# Altium project MICROPROCESSOR.PrjPcb (part 2 of 2)
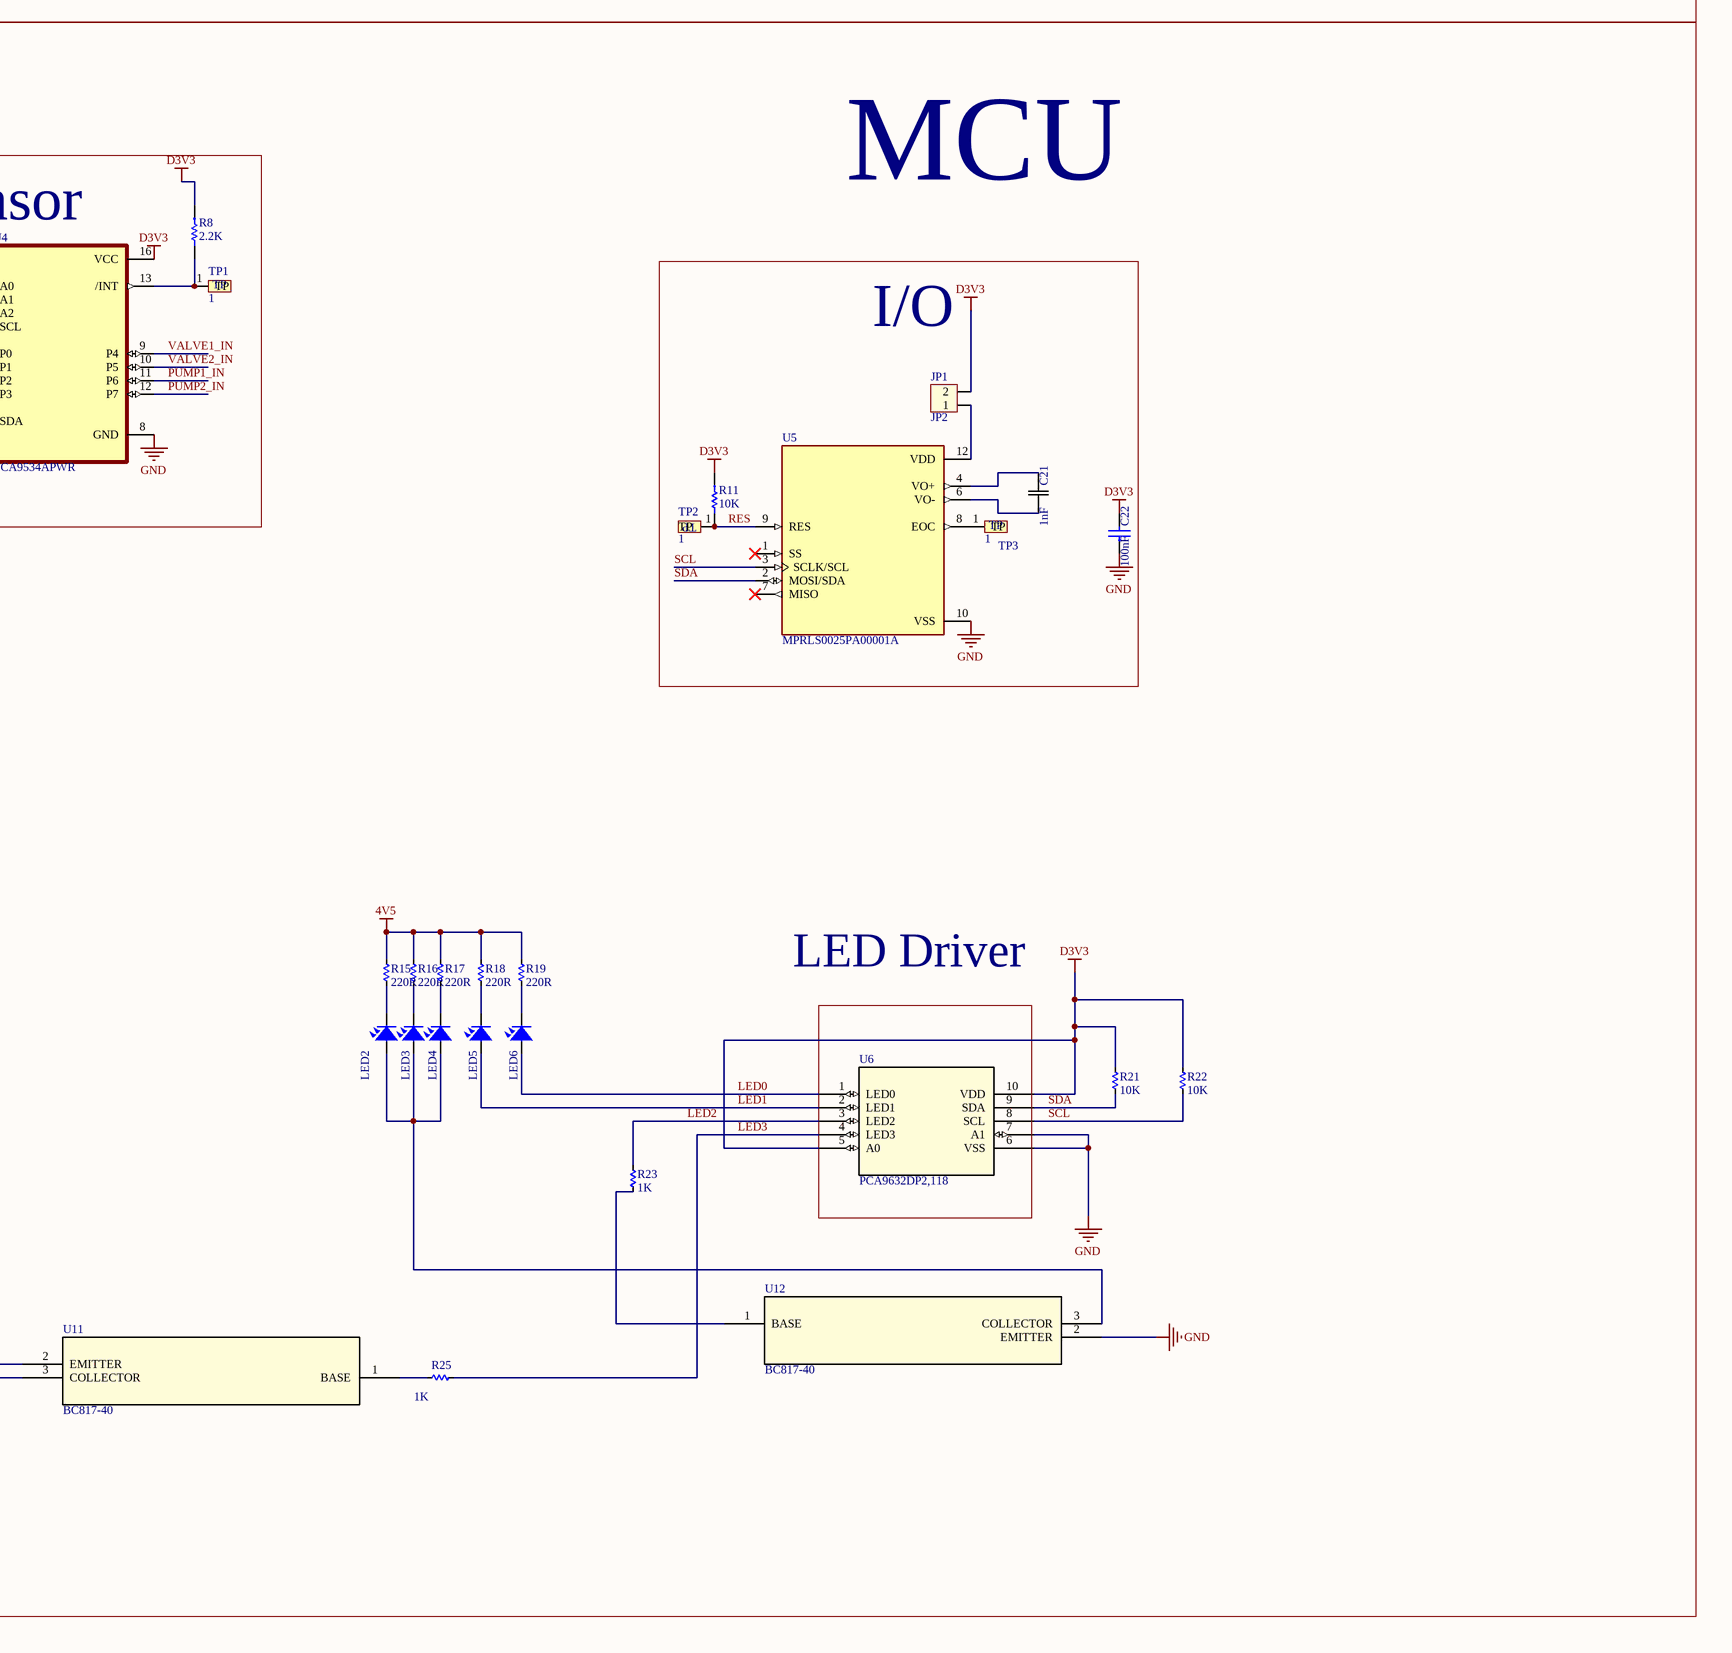
[diagram p4: schematic1.SchDoc, bottom right]

## Sheet schematic1.SchDoc (continued)

### Library data of the parts
C1 C8 = CAPCER0001 100nF 10% 50V X7R 0603 SMD_1: CAP CER 100nF 10% 50V X7R 0603 SMD; LINE: SMT; TYPE: EP; UNIT: PCS; TMG CODE: None; CERTIFICATION: NA; CLASS: B; Value: 100n; MOUNT: SMD; TMG PN: CAPCER0001; ComponentLink1Description: Datasheet; ComponentLink1URL: https://datasheet.lcsc.com/lcsc/1811021431_Samsung-Electro-Mechanics-CL10B104KB8NNNC_C1591.pdf; Footprint: 0603
C2 C10 = CL10A106MQ8NNNC: Description; Manufacturer_Name: Samsung; Copyright: Copyright (C) 2026 Ultra Librarian. All rights reserved.; Manufacturer_Part_Number: CL10A106MQ8NNNC
  C2: Value: 10uF
C3 C9 = CL10A106MQ8NNNC: Description; Manufacturer_Name: Samsung; Value: 10u; Copyright: Copyright (C) 2026 Ultra Librarian. All rights reserved.; Manufacturer_Part_Number: CL10A106MQ8NNNC
C4 C20 C22-C24 C28 C29 = CAPCER0001 100nF 10% 50V X7R 0603 SMD: CAP CER 100nF 10% 50V X7R 0603 SMD; LINE: SMT; TYPE: EP; UNIT: PCS; TMG CODE: None; CERTIFICATION: NA; CLASS: B; MOUNT: SMD; TMG PN: CAPCER0001; ComponentLink1Description: Datasheet; ComponentLink1URL: https://datasheet.lcsc.com/lcsc/1811021431_Samsung-Electro-Mechanics-CL10B104KB8NNNC_C1591.pdf; Footprint: 0603
C5-C7 C12 C13 = GRM188R60J226MEA0D: Description; Manufacturer_Name: Murata; Value: 22u; Copyright: Copyright (C) 2026 Ultra Librarian. All rights reserved.; Manufacturer_Part_Number: GRM188R60J226MEA0D
C11 = CAPCER0001 100nF 10% 50V X7R 0603 SMD: CAP CER 100nF 10% 50V X7R 0603 SMD; LINE: SMT; TYPE: EP; UNIT: PCS; TMG CODE: None; CERTIFICATION: NA; CLASS: B; Value: 100n; MOUNT: SMD; TMG PN: CAPCER0001; ComponentLink1Description: Datasheet; ComponentLink1URL: https://datasheet.lcsc.com/lcsc/1811021431_Samsung-Electro-Mechanics-CL10B104KB8NNNC_C1591.pdf; Footprint: 0603
C14 = GRM188R60J226MEA0D: Description; Manufacturer_Name: Murata; Copyright: Copyright (C) 2026 Ultra Librarian. All rights reserved.; Manufacturer_Part_Number: GRM188R60J226MEA0D
C15 C17 C18 = GMC10X7R106K10NT: CAP0603 X7R 10UF 10% 10V; manufacturer: Cal-Chip Electronics, Inc.; Capacitance: 10 µF; Part Number: GMC10X7R106K10NT; Value: 10u; Applications: General Purpose; componentlink1description: Datasheet; componentlink1url: https://88ce57.p3cdn1.secureserver.net/wp-content/uploads/2023/01/gmc_series-2.pdf; componentlink2description: DigiKey Link; componentlink2url: https://www.digikey.com/en/products/detail/cal-chip-electronics-inc/GMC10X7R106K10NT/18151126; Device Package: 0603 (1608 Metric); lastupdated: 2/9/2024 8:09:39 PM; Lifecycle Status: Active; Minimum Order: 1; Mounting Type: Surface Mount, MLCC; Operating Temperature: -55°C ~ 125°C; Package / Case: 0603 (1608 Metric); packaging: TapeAndReel; partid: 49835; Part Status: Active; price: 0.26; series: GMC; Size / Dimension: 0.063" L x 0.031" W (1.60mm x 0.80mm); Supplier 1: DigiKey; Supplier Part Number 1: 4713-GMC10X7R106K10NTCT-ND; Temperature Coefficient: X7R; Thickness (Max): 0.039" (1.00mm); Tolerance: ±10%; Voltage - Rated: 10V
C16 = GMC10X7R106K10NT: CAP0603 X7R 100nF 10% 10V; manufacturer: Cal-Chip Electronics, Inc.; Capacitance: 10 µF; Part Number: GMC10X7R106K10NT; Value: 100n; Applications: General Purpose; componentlink1description: Datasheet; componentlink1url: https://88ce57.p3cdn1.secureserver.net/wp-content/uploads/2023/01/gmc_series-2.pdf; componentlink2description: DigiKey Link; componentlink2url: https://www.digikey.com/en/products/detail/cal-chip-electronics-inc/GMC10X7R106K10NT/18151126; Device Package: 0603 (1608 Metric); lastupdated: 2/9/2024 8:09:39 PM; Lifecycle Status: Active; Minimum Order: 1; Mounting Type: Surface Mount, MLCC; Operating Temperature: -55°C ~ 125°C; Package / Case: 0603 (1608 Metric); packaging: TapeAndReel; partid: 49835; Part Status: Active; price: 0.26; series: GMC; Size / Dimension: 0.063" L x 0.031" W (1.60mm x 0.80mm); Supplier 1: DigiKey; Supplier Part Number 1: 4713-GMC10X7R106K10NTCT-ND; Temperature Coefficient: X7R; Thickness (Max): 0.039" (1.00mm); Tolerance: ±10%; Voltage - Rated: 10V
C19 = UWT1C101MCL1GB: CAP ALUM 100UF 20% / 16V SMD; Supplier 1: Digi-Key; Supplier Part Number 1: 493-2177-2-ND
C21 = GCJ188R71H102KA01D: No Description Available; Manufacturer_Name: Murata; Type: Ceramic Capacitors; Copyright: Copyright (C) 2026 Ultra Librarian. All rights reserved.; Manufacturer_Part_Number: GCJ188R71H102KA01D
C27 C30-C32 = UWT1C101MCL1GB: Supplier 1: Digi-Key; Supplier Part Number 1: 493-2177-2-ND
D1 D5 D7 D10 D11 = SS34: Schottky Diode 40V 3A SMA; Supplier 1: Digi-Key; Supplier Part Number 1: SS34-E3/57TGICT-ND; Value: SS34
D2-D4 D6 D8 D9 = LTST-C190KRKT: Lite-On LED Red 0603; Supplier Part Number 1: 160-1436-1-ND; Supplier 1: Digi-Key; Supplier Part Number 2: FL1413
  D3 D4 D6 D8 D9: Value: LED Red
F1 = C1F5: Fuse Chip Fast Acting 5A 125V SMD Solder Pad 1206 3.2 X 1.58 X 0.63mm; Manufacturer: Bel TRP; Voltage Rating (DC): 63V; DC Cold Resistance: 20mR; Fuse Type: Board Mount (Cartridge Style Excluded); Supplier 1: Newark; Manufacturer Part Number: C1F5; RoHS: Yes; Category: Uncategorized; Mount: Surface Mount; Case/Package: 1206; Number of Pins: 2; Contact Plating: Tin; Case Code (Metric): 3216; Case Code (Imperial): 1206; Min Operating Temperature: -55°C; Max Operating Temperature: 125°C; Packaging: Cut Tape; Voltage Rating: 125V; Series: C1F; Voltage Rating (AC): 125V; ComponentLink1URL: http://www.mouser.com/ds/2/643/C1F-594910.pdf?src-supplier=Mouser; ComponentLink1Description: http://www.mouser.com/ds/2/643/C1F-594910.pdf?src-supplier=Mouser; ComponentLink2URL: http://belfuse.com/pdfs/C1F.pdf?src-supplier=Avnet; ComponentLink2Description: http://belfuse.com/pdfs/C1F.pdf?src-supplier=Avnet; ComponentLink3URL: https://belfuse.com/resources/datasheets/circuitprotection/ds-cp-c1f-series.pdf?src-supplier=Digikey; ComponentLink3Description: https://belfuse.com/resources/datasheets/circuitprotection/ds-cp-c1f-series.pdf?src-supplier=Digikey; Supplier Part Number 1: 48AC8480
FB1 = BLM18KG331SH1D: FERRITE BEAD 330 OHM 0603 1LN; Manufacturer: Murata Electronics; Current Rating (Max): 1.7A; DC Resistance (DCR) (Max): 80mOhm; Filter Type: Power Line; Impedance @ Frequency: 330 Ohms @ 100 MHz; Number of Lines: 1; Part Number: BLM18KG331SH1D; ComponentLink1Description: Datasheet; ComponentLink1URL: https://www.murata.com/en-global/products/productdata/8796737273886/QNFA9101.pdf; ComponentLink2Description: DigiKey Link; ComponentLink2URL: https://www.digikey.com/en/products/detail/murata-electronics/BLM18KG331SH1D/5881246; Device Package: 0603 (1608 Metric); Height (Max): 0.037" (0.95mm); LastUpdated: 3/11/2024 7:43:28 AM; Lifecycle Status: Active; Minimum Order: 1; Mounting Type: Surface Mount; Operating Temperature: -55°C ~ 125°C; Package / Case: 0603 (1608 Metric); Packaging: TapeAndReel; PartId: 932; Part Status: Active; Price: 0.02; Ratings: AEC-Q200; Series: EMIFIL®, BLM18; Size / Dimension: 0.063" L x 0.032" W (1.60mm x 0.80mm); Supplier 1: DigiKey; Supplier Part Number 1: 490-13257-1-ND; Value: 330
J1 J2 J4 J5 = PRT-14417: QWIIC JST CONNECTOR - SMD 4-PIN; MF: SparkFun Electronics; SnapEDA_Link: https://www.snapeda.com/parts/PRT-14417/SparkFun+Electronics/view-part/?ref=snap; Package: None; Value: *; MP: PRT-14417; Check_prices: https://www.snapeda.com/parts/PRT-14417/SparkFun+Electronics/view-part/?ref=eda
J3 = JP4: Jumper 3; Value: J3
JDC1 = DCIN: Jac DC input; Value: Jac DC
JP1 = Con2: jumper 2.0 B; Value: Connector 2
L1 L2 = INDMOI0016 1W2T 2.2uH 20% 5A 0420 SMD: IND MOI 1W2T 4.7uH 20% 5A 0420 SMD; LINE: SMT; TYPE: EP; UNIT: PCS; TMG CODE: None; CERTIFICATION: NA; CLASS: B; MOUNT: SMD; ComponentLink1Description: Datasheet; ComponentLink1URL: https://datasheet.lcsc.com/lcsc/2305161117_cjiang--Changjiang-Microelectronics-Tech-FXL0420-2R2-M_C167206.pdf
LED1-LED6 = LED: LED Single colour Green and Red; Value: LED 3 ly Single Colour
Q3-Q6 = IRFML8244TRPBF: MOSFET N-CH 25V 5.8A SOT23; Supplier 1: Digi-Key; Supplier Part Number 1: IRFML8244TRPBFCT-ND; Value: AO3400A
R1 R4 = RC0603JR-07100KL: Yageo RES 100K 5% 1/10W 0603; Supplier 1: Digi-Key; Supplier Part Number 1: 311-100KGRCT-ND; Supplier Part Number 2: FL2402
R2 R3 R5 R6 = RESCHP0195 2K7 1% 0603 SMD: RES CHP 2K7 1% 1/10W 0603 SMD; LINE: SMT; UNIT: PCS; TMG CODE: None; CERTIFICATION: NA; CLASS: B; MOUNT: SMD; TYPE: EP; TMG PN: RESCHP0195; ComponentLink1Description: Datasheet; ComponentLink1URL: https://datasheet.lcsc.com/lcsc/2304140030_YAGEO-RC0603FR-072K7L_C114612.pdf; Footprint: 0603
  R3: Value: 30k
R7 = Resistor 2.2K: Res Thick Film 0603 2.2K Ohm 5% 1/10W ±200ppm/°C Molded SMD SMD Paper T/R; Manufacturer: Vishay; Manufacturer Part Number: CRCW06032K20JNEA; Resistance: 2.2kR; Power Rating: 100mW; Voltage Rating: 75V; Supplier 1: Arrow Electronics; RoHS: Yes; Category: Chip SMD Resistors; Stock 1: 130000; Pricing 1: 5000=0.0053 (USD); Case/Package: 0603; Weight: 7.1E-05oz; Case Code (Metric): 1608; Case Code (Imperial): 0603; Contact Plating: Tin; Size Code: 0603; Min Operating Temperature: -55°C; Max Operating Temperature: 155°C; Package Quantity: 5000; Tolerance: 5%; Packaging: Tape and Reel; Resistor Type: Thick Film; Number of Terminations: 2; Temperature Coefficient: 200ppm/°C; Termination: SMD/SMT; Max Power Dissipation: 100mW; Features: Automotive AEC-Q200; Series: CRCW; Resistance Tolerance: 5%; Construction: Rectangular; Length: 1.55mm; Width: 0.85mm; Height: 0.45mm; Depth: 0.85mm; Ratings: AEC-Q200; Radiation Hardening: No; Military Standard: Not; RoHS Compliant: Yes; Reach SVHC Compliant: Unknown; Lead Free: 5697LeadFree; ComponentLink1URL: https://datasheet.ciiva.com/2462/dcrcwe3-2462048.pdf?src-supplier=Digikey; ComponentLink1Description: https://datasheet.ciiva.com/2462/dcrcwe3-2462048.pdf?src-supplier=Digikey; ComponentLink2URL: https://datasheet.ciiva.com/16767/70201119-16767464.pdf?src-supplier=Allied+Electronics; ComponentLink2Description: https://datasheet.ciiva.com/16767/70201119-16767464.pdf?src-supplier=Allied+Electronics; ComponentLink3URL: https://datasheet.ciiva.com/2462/dcrcwe3-2462046.pdf?src-supplier=Digikey; ComponentLink3Description: https://datasheet.ciiva.com/2462/dcrcwe3-2462046.pdf?src-supplier=Digikey; ComponentLink4URL: https://datasheet.ciiva.com/5541/dcrcwe3-109170-5541959.pdf?src-supplier=Mouser; ComponentLink4Description: https://datasheet.ciiva.com/5541/dcrcwe3-109170-5541959.pdf?src-supplier=Mouser; ComponentLink5URL: https://datasheet.ciiva.com/16286/dcrcwe3-16286997.pdf?src-supplier=Future+Electronics; ComponentLink5Description: https://datasheet.ciiva.com/16286/dcrcwe3-16286997.pdf?src-supplier=Future+Electronics; Supplier Part Number 1: CRCW06032K20JNEA; Value: 1K
R8-R14 R28 R29 = RESCHP0428 8K4 1% 0603 SMD: RES CHP 8K4 1% 1/10W 0603 SMD; LINE: SMT; UNIT: PCS; TMG CODE: None; CERTIFICATION: NA; CLASS: B; MOUNT: SMD; TYPE: EP; ComponentLink1Description: Datasheet; ComponentLink1URL: https://datasheet.lcsc.com/lcsc/2304140030_YAGEO-RT0603FRD07100RL_C160603.pdf
R15-R23 R25 = Res-SMD: Resistor; Manufacturer: Generic Components; Class: Passive; Published: 08/06/2000; Publisher: Altium Hobart Technology Centre
R27 R32 R35 R36 = RC0603JR-071KL: Yageo RES 1K 5% 1/10W 0603; Supplier 1: LCSC; Supplier Part Number 1: C131707
R30 R33 R37 R38 = RC0603JR-07100RL: Yageo RES 100R 5% 1/10W 0603; Supplier 1: Digi-Key; Supplier Part Number 1: 311-100GRCT-ND; Supplier Part Number 2: FL2438
R31 R34 R39 R40 = RC0603JR-0710KL: Yageo RES 10K 5% 1/10W 0603; Supplier 1: Digi-Key; Supplier Part Number 1: 311-10KGRCT-ND; Supplier Part Number 2: FL2403
SW1-SW4 = SW2: Switch button 4 pin
SW5 = SW2: Switch button 2 pin; Value: SW chip 2 pin
TP1-TP3 = TP: CONNECT 1
U1 U2 = ICSOCV0021 BCK TPS563201 3A SOT23-6 SMD: ICS OCV BCK TPS563201 3A SOT23-6 SMD; LINE: SMT; UNIT: PCS; TMG CODE: None; CERTIFICATION: NA; CLASS: B; MOUNT: SMD; TYPE: EP; ComponentLink1Description: Datasheet; ComponentLink1URL: https://datasheet.lcsc.com/lcsc/2304241919_Texas-Instruments-TPS563201DDCR_C116592.pdf
U3 = AP2112K-3.3TRG1: AP2112 Series 0.6 A 3.3 V Fixed Output SMT LDO Linear Regulator - SOT23-5; MF: Diodes Inc.; Value: 1K; Availability: Unavailable; Package: SOT-753 Diodes Inc.; Price: None; SnapEDA_Link: https://www.snapeda.com/parts/AP2112K-3.3TRG1/Diodes%20Inc./view-part/?ref=snap; MP: AP2112K-3.3TRG1
U4 = TCA9534APWR: 8-bit 1.65- to 5.5-V I2C/SMBus I/O expander with interrupt, & config registers; MF: Texas Instruments; SnapEDA_Link: https://www.snapeda.com/parts/TCA9534APWR/Texas+Instruments/view-part/?ref=snap; Package: TSSOP-16 Texas Instruments; Value: *; MP: TCA9534APWR; Check_prices: https://www.snapeda.com/parts/TCA9534APWR/Texas+Instruments/view-part/?ref=eda
U5 = MPRLS0025PA00001A: Pressure Sensor 25PSI _172.37kPa_ Absolute Male - 0.1 _2.5mm_ Tube 24 b 12-SMD Module; MF: Honeywell Sensing; MP: MPRLS0025PA00001A; SnapEDA_Link: https://www.snapeda.com/parts/MPRLS0025PA00001A/Honeywell%20Sensing%20and%20Productivity%20Solutions/view-part/2772767/?ref=snap; Digi-Key_Part_Number: 480-7098-1-ND; Package: SMD-10 Honeywell; Value: *
U6 = PCA9632DP2,118: No Description Available; Manufacturer_Name: NXP; Copyright: Copyright (C) 2026 Ultra Librarian. All rights reserved.; Manufacturer_Part_Number: PCA9632DP2,118; RefDes: RefDes; Type: Type
U7-U10 = A5F083: Connector Header 2 Position 6.35mm Solder Straight Thru-Hole 2 Terminal 1 Port MLX-Series; Manufacturer: Molex; Manufacturer Lifecycle Status: ACTIVE; Connector Type: Power; Contact Resistance: 3.5mΩ; Current Rating: 13.5A; Dielectric Material: Polyester; Gender: Female; Glow Wire Compliant: Non-compliant; Insulation Resistance: 1GΩ; Number of Circuits: 2; Operating Force: 6.672N; Plating: Tin; Plating Thickness: 3.5052µm; Voltage Rating: 600V; Supplier 1: Arrow Electronics; Manufacturer Part Number: 10-84-4022; RoHS: Compliant; Category: Headers and Wire Housings; Stock 1: 4724; Pricing 1: 1=0,2907, 10=0,267, 100=0,245, 500=0,229, 1836=0,216 (USD); China RoHS: Compliant; Color: Natural; Contact Gender: Female; Contact Material: Bronze; Contact Plating: Tin; Country of Origin: US; Flammability Rating: UL94 V-2; Halogen Free: Low Halogen; Housing Material: Nylon; Lead Free: Lead Free; Lifecycle Status: Production; Max Operating Temperature: 105°C; Min Operating Temperature: -55°C; Mount: Through Hole; Number of Contacts: 2; Number of Pins: 2; Number of Positions: 2; Number of Rows: 1; Orientation: Vertical; Packaging: Carton; Pitch: 6.35mm; Radiation Hardening: No; REACH SVHC: Yes; Schedule B: 8536694040, 8536694040|8536694040|8536694040|8536694040|8536694040; Shell Material: POLYAMIDE66; Terminal Pitch: 6.35mm; Termination: Solder; ComponentLink1URL: https://datasheet.octopart.com:443/10-84-4022-Molex-datasheet-137053637.pdf?src-supplier=element14+APAC; ComponentLink1Description: https://datasheet.octopart.com:443/10-84-4022-Molex-datasheet-137053637.pdf?src-supplier=element14+APAC; ComponentLink2URL: https://datasheet.octopart.com:443/10-84-4022-Molex-datasheet-13791970.pdf?src-supplier=Molex; ComponentLink2Description: https://datasheet.octopart.com:443/10-84-4022-Molex-datasheet-13791970.pdf?src-supplier=Molex; ComponentLink3URL: https://sigma.octopart.com:443/16272272/technical_drawing/Molex-10-84-4022.pdf?src-supplier=Molex; ComponentLink3Description: https://sigma.octopart.com:443/16272272/technical_drawing/Molex-10-84-4022.pdf?src-supplier=Molex; ComponentLink4URL: https://datasheet.octopart.com:443/010844022-Molex-datasheet-5390850.pdf?src-supplier=Molex; ComponentLink4Description: https://datasheet.octopart.com:443/010844022-Molex-datasheet-5390850.pdf?src-supplier=Molex; ComponentLink5URL: https://datasheet.octopart.com:443/10-84-4022-Molex-datasheet-154742841.pdf?src-supplier=Master+Electronics; ComponentLink5Description: https://datasheet.octopart.com:443/10-84-4022-Molex-datasheet-154742841.pdf?src-supplier=Master+Electronics; ComponentLink6URL: https://datasheet.octopart.com:443/10-84-4022-Molex-datasheet-33343972.pdf?src-supplier=Electro+Sonic; ComponentLink6Description: https://datasheet.octopart.com:443/10-84-4022-Molex-datasheet-33343972.pdf?src-supplier=Electro+Sonic; ComponentLink7URL: https://datasheet.octopart.com:443/10-84-4022-Molex-datasheet-21205596.pdf?src-supplier=Electro+Sonic; ComponentLink7Description: https://datasheet.octopart.com:443/10-84-4022-Molex-datasheet-21205596.pdf?src-supplier=Electro+Sonic; ComponentLink8URL: https://datasheet.octopart.com:443/10-84-4022-Molex-datasheet-62102692.pdf?src-supplier=Electro+Sonic; ComponentLink8Description: https://datasheet.octopart.com:443/10-84-4022-Molex-datasheet-62102692.pdf?src-supplier=Electro+Sonic; ComponentLink9URL: https://datasheet.octopart.com:443/10-84-4022-Molex-datasheet-140174504.pdf?src-supplier=RS+(Formerly+Allied+Electronics); ComponentLink9Description: https://datasheet.octopart.com:443/10-84-4022-Molex-datasheet-140174504.pdf?src-supplier=RS+(Formerly+Allied+Electronics); ComponentLink10URL: https://datasheet.octopart.com:443/10-84-4022-Molex-datasheet-120134962.pdf?src-supplier=RS+(Formerly+Allied+Electronics); ComponentLink10Description: https://datasheet.octopart.com:443/10-84-4022-Molex-datasheet-120134962.pdf?src-supplier=RS+(Formerly+Allied+Electronics); ComponentLink11URL: https://datasheet.octopart.com:443/10-84-4022-Molex-datasheet-32867450.pdf?src-supplier=Newark; ComponentLink11Description: https://datasheet.octopart.com:443/10-84-4022-Molex-datasheet-32867450.pdf?src-supplier=Newark; ComponentLink12URL: https://datasheet.octopart.com:443/10844022-Molex-datasheet-8320017.pdf?src-supplier=Jameco; ComponentLink12Description: https://datasheet.octopart.com:443/10844022-Molex-datasheet-8320017.pdf?src-supplier=Jameco; ComponentLink13URL: https://datasheet.octopart.com:443/10-84-4022-Molex-datasheet-5314522.pdf?src-supplier=Verical; ComponentLink13Description: https://datasheet.octopart.com:443/10-84-4022-Molex-datasheet-5314522.pdf?src-supplier=Verical; ComponentLink14URL: https://datasheet.octopart.com:443/10-84-4022-Molex-datasheet-27226.pdf?src-supplier=DigiKey; ComponentLink14Description: https://datasheet.octopart.com:443/10-84-4022-Molex-datasheet-27226.pdf?src-supplier=DigiKey; ComponentLink15URL: http://sigma.octopart.com:80/16272275/rohs_statement/Molex-10-84-4022.pdf?src-supplier=Compliance+Statements; ComponentLink15Description: http://sigma.octopart.com:80/16272275/rohs_statement/Molex-10-84-4022.pdf?src-supplier=Compliance+Statements; ComponentLink16URL: http://sigma.octopart.com:80/reach_statement/Molex-company-74.pdf?src-supplier=Compliance+Statements; ComponentLink16Description: http://sigma.octopart.com:80/reach_statement/Molex-company-74.pdf?src-supplier=Compliance+Statements; ComponentLink17URL: http://sigma.octopart.com:80/rohs_statement/Molex-company-73.pdf?src-supplier=Compliance+Statements; ComponentLink17Description: http://sigma.octopart.com:80/rohs_statement/Molex-company-73.pdf?src-supplier=Compliance+Statements; ComponentLink18URL: http://sigma.octopart.com:80/conflict_mineral_statement/Molex-company-72.pdf?src-supplier=Compliance+Statements; ComponentLink18Description: http://sigma.octopart.com:80/conflict_mineral_statement/Molex-company-72.pdf?src-supplier=Compliance+Statements; Supplier Part Number 1: 0010844022
U11 U12 = BC817-40: No Description Available; Manufacturer_Name: Nexperia; Copyright: Copyright (C) 2026 Ultra Librarian. All rights reserved.; Manufacturer_Part_Number: BC817-40; RefDes: RefDes; Type: Type